# EAGLE design SensorBoard (EAGLE 6.5.0)
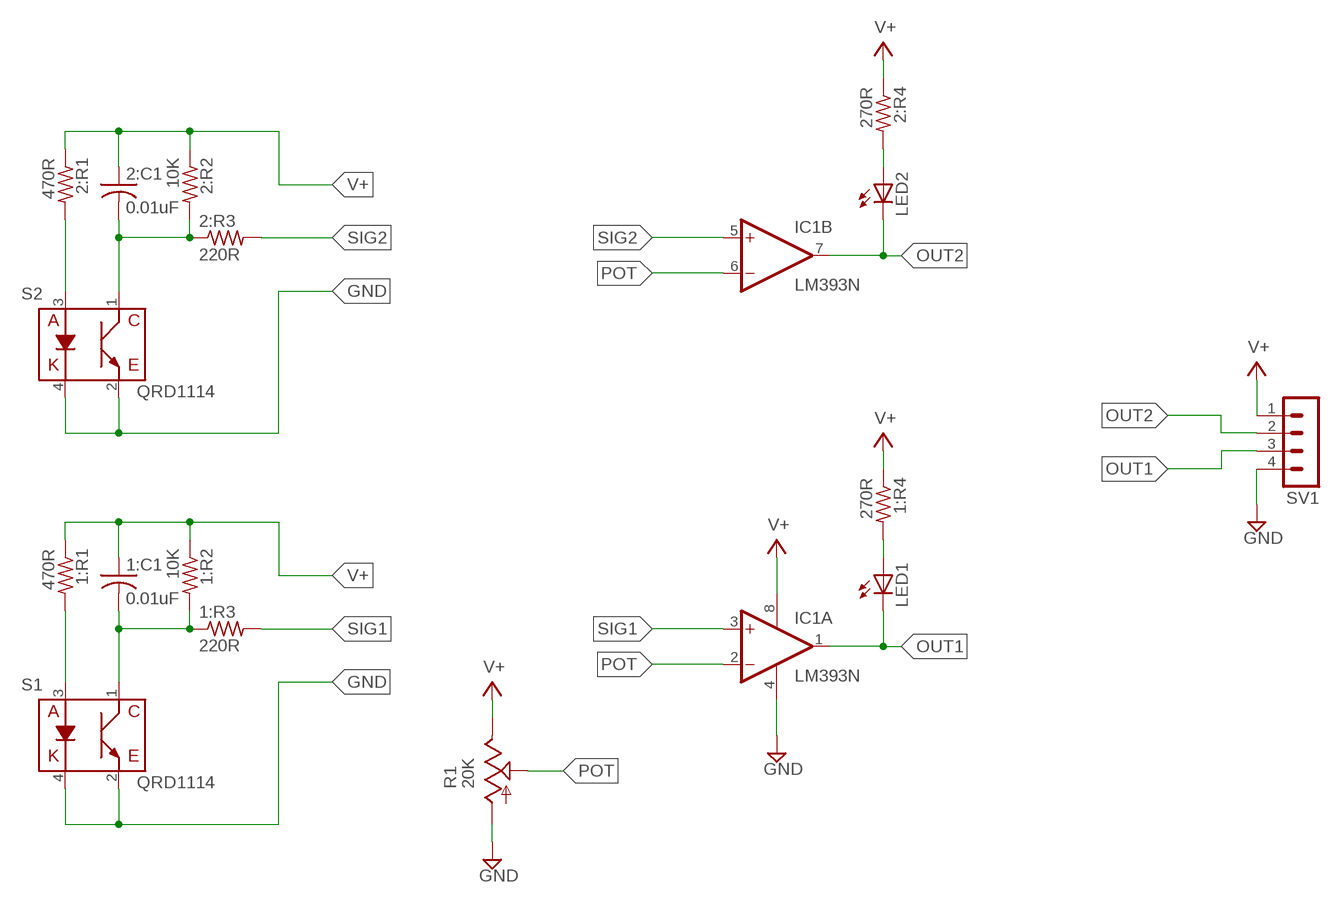
[diagram p0: schematic, sheet 1]

## Parts
1:C1  0.01uF  C-US025-025X050  [C025-025X050]
1:R1  470R  R-US_0207/12  [0207/12]
1:R2  10K  R-US_0207/12  [0207/12]
1:R3  220R  R-US_0207/10  [0207/10]
1:R4  270R  R-US_0207/12  [0207/12]
2:C1  0.01uF  C-US025-025X050  [C025-025X050]
2:R1  470R  R-US_0207/12  [0207/12]
2:R2  10K  R-US_0207/12  [0207/12]
2:R3  220R  R-US_0207/10  [0207/10]
2:R4  270R  R-US_0207/12  [0207/12]
IC1  LM393N  [DIL08]
LED1  LED5MM  [LED5MM]
LED2  LED5MM  [LED5MM]
R1  20K  TRIM_US-B25P  [B25P]
S1  QRD1114  [QRD1114]
S2  QRD1114  [QRD1114]
SV1  MA04-1  [MA04-1]

## Nets
GND: IC1.4(P:V-) R1.A S1.2(C) S1.4(K) S2.2(C) S2.4(K) SV1.4
N$1: 2:R4.2 LED2.A
N$2: 1:C1.2 1:R2.2 1:R3.1 S1.1(E)
N$3: 1:R1.2 S1.3(A)
N$4: 2:C1.2 2:R2.2 2:R3.1 S2.1(E)
N$5: 2:R1.2 S2.3(A)
N$6: 1:R4.2 LED1.A
OUT1: IC1.1(A:OUT) LED1.K(C) SV1.3
OUT2: IC1.7(B:OUT) LED2.K(C) SV1.2
POT: IC1.2(A:-IN) IC1.6(B:-IN) R1.S
SIG1: 1:R3.2 IC1.3(A:+IN)
SIG2: 2:R3.2 IC1.5(B:+IN)
V+: 1:C1.1 1:R1.1 1:R2.1 1:R4.1 2:C1.1 2:R1.1 2:R2.1 2:R4.1 IC1.8(P:V+) R1.E SV1.1

## Library data of the parts
1:C1 2:C1 = resistor:C-US: CAPACITOR, American symbol
1:R1-1:R4 2:R1-2:R4 = resistor:R-US_: RESISTOR, American symbol
IC1 = linear:LM393: COMPARATOR
LED1 LED2 = led:LED: LED OSRAM: - CHIPLED LG R971, LG N971, LY N971, LG Q971, LY Q971, LO R971, LY R971 LH N974, LH R974 LS Q976, LO Q976, LY Q976 LO Q996 - Hyper CHIPLED LW Q18S LB Q993, LB Q99A, LB R99A - SideLED LS A670, LO A670, LY A670, LG A670, LP A670 LB A673, LV A673, LT A673, LW A673 LH A674 LY A675 LS A676, LA A676, LO A676, LY A676, LW A676 LS A679, LY A679, LG A679 - Hyper Micro SIDELED® LS Y876, LA Y876, LO Y876, LY Y876 LT Y87S - SmartLED LW L88C, LW L88S LB L89C, LB L89S, LG L890 LS L89K, LO L89K, LY L89K LS L896, LA L896, LO L896, LY L896 - TOPLED LS T670, LO T670, LY T670, LG T670, LP T670 LSG T670, LSP T670, LSY T670, LOP T670, LYG T670 LG T671, LOG T671, LSG T671 LB T673, LV T673, LT T673, LW T673 LH T674 LS T676, LA T676, LO T676, LY T676, LB T676, LH T676, LSB T676, LW T676 LB T67C, LV T67C, LT T67C, LS T67K, LO T67K, LY T67K, LW E67C LS E67B, LA E67B, LO E67B, LY E67B, LB E67C, LV E67C, LT E67C LW T67C LS T679, LY T679, LG T679 LS T770, LO T770, LY T770, LG T770, LP T770 LB T773, LV T773, LT T773, LW T773 LH T774 LS E675, LA E675, LY E675, LS T675 LS T776, LA T776, LO T776, LY T776, LB T776 LHGB T686 LT T68C, LB T68C - Hyper Mini TOPLED® LB M676 - Mini TOPLED Santana® LG M470 LS M47K, LO M47K, LY M47K Source: http://www.osram.convergy.de LUXEON: - LUMILED® LXK2-PW12-R00, LXK2-PW12-S00, LXK2-PW14-U00, LXK2-PW14-V00 LXK2-PM12-R00, LXK2-PM12-S00, LXK2-PM14-U00 LXK2-PE12-Q00, LXK2-PE12-R00, LXK2-PE12-S00, LXK2-PE14-T00, LXK2-PE14-U00 LXK2-PB12-K00, LXK2-PB12-L00, LXK2-PB12-M00, LXK2-PB14-N00, LXK2-PB14-P00, LXK2-PB14-Q00 LXK2-PR12-L00, LXK2-PR12-M00, LXK2-PR14-Q00, LXK2-PR14-R00 LXK2-PD12-Q00, LXK2-PD12-R00, LXK2-PD12-S00 LXK2-PH12-R00, LXK2-PH12-S00 LXK2-PL12-P00, LXK2-PL12-Q00, LXK2-PL12-R00 Source: www.luxeon.com KINGBRIGHT: KA-3528ASYC Source: www.kingbright.com
R1 = pot:TRIM_US-: POTENTIOMETER
S1 S2 = SparkFun-Sensors:QRD1114: Reflective object sensor
SV1 = con-lstb:MA04-1: PIN HEADER; OC_FARNELL: unknown; OC_NEWARK: unknown

## Board
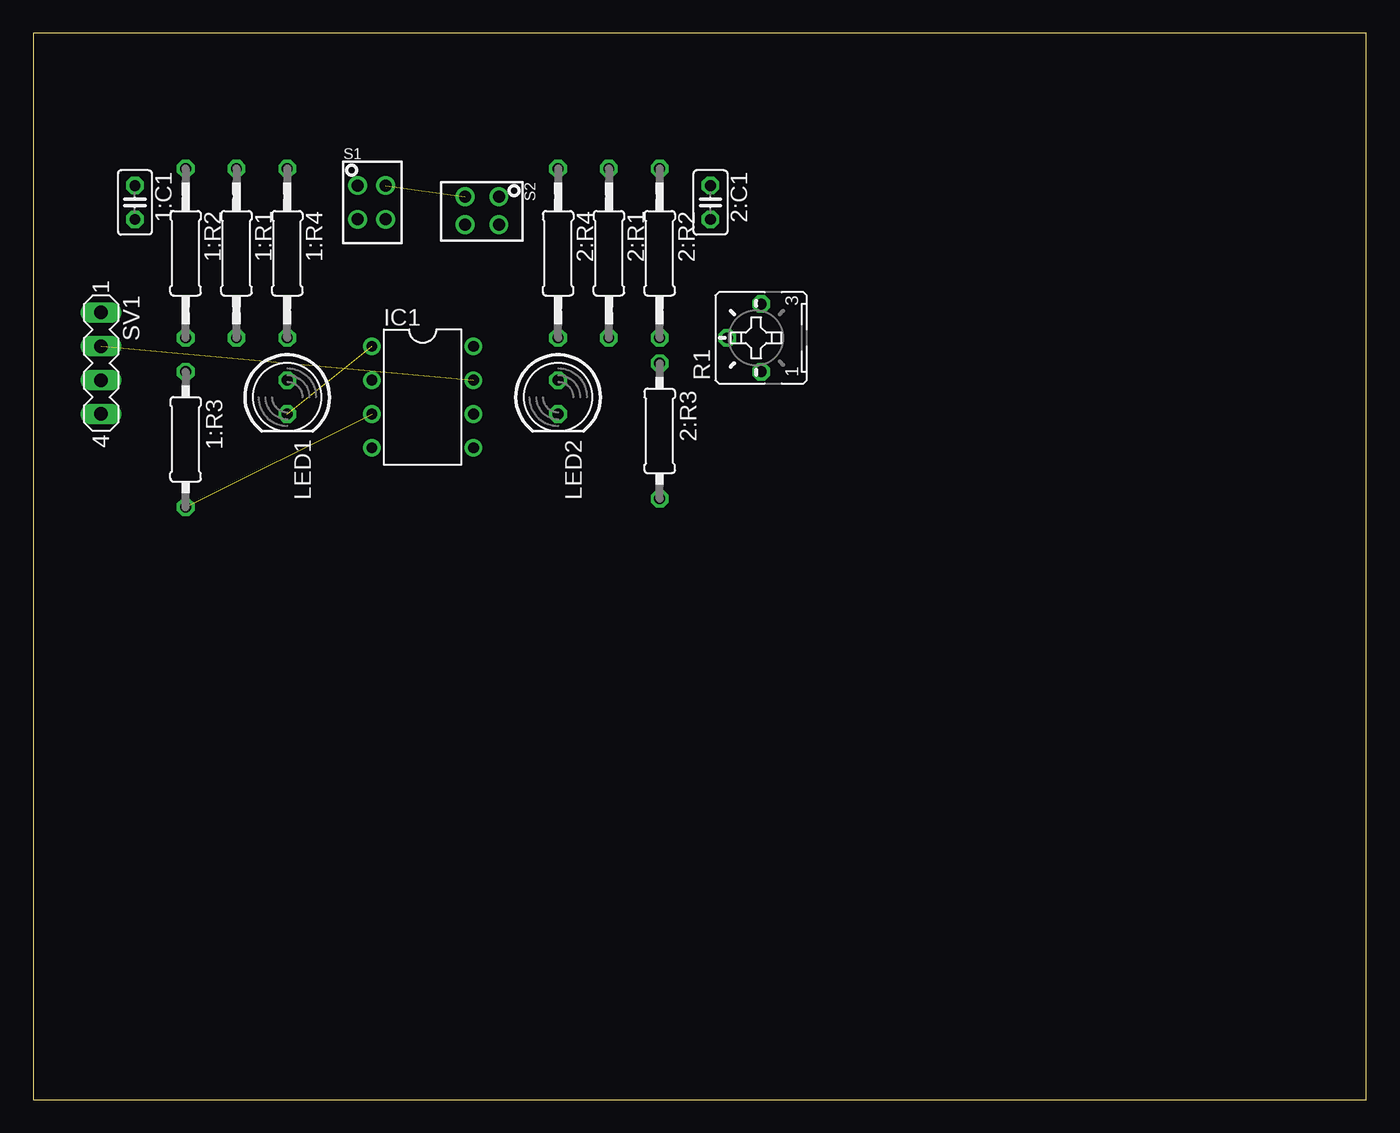
[diagram p1: board, top side]
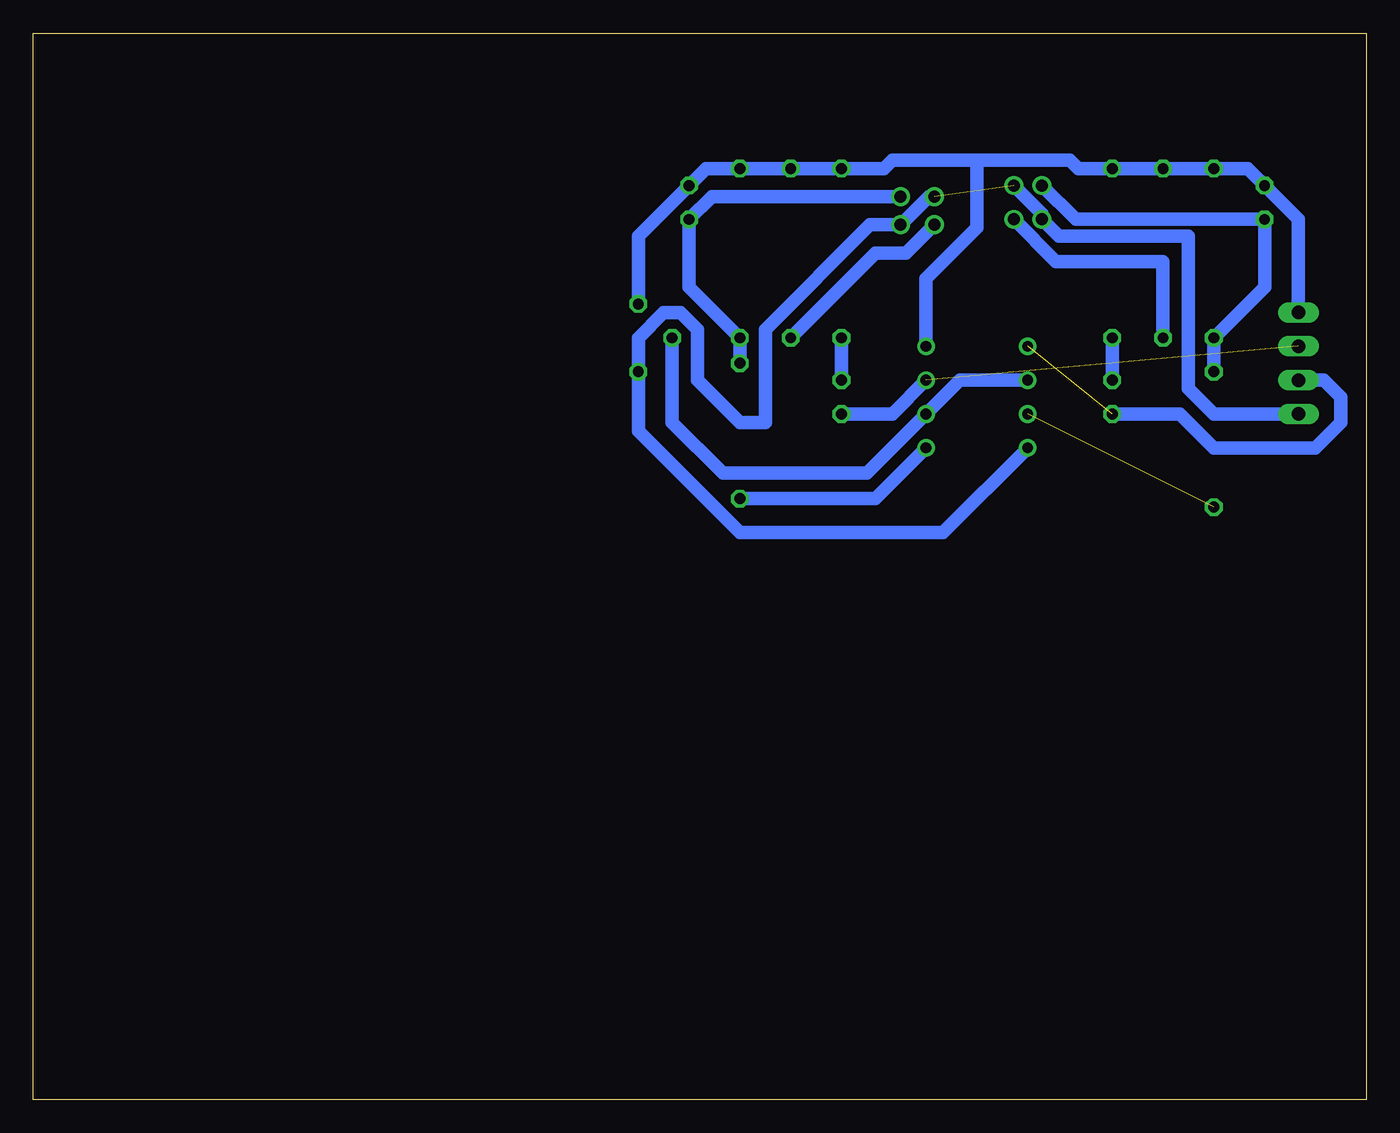
[diagram p2: board, bottom side, seen from below]

Size 100 x 80 mm. Coordinates in mm from the lower left corner, seen from the top.
Outline: 0,0 100,0 100,80 0,80 0,0
Copper layers (1*16): Top 0.035mm / dielectric 1.5mm / Bottom 0.035mm
Design rules "default": minimum track width 10mil, minimum drill 24mil, track to track 8mil, track to pad 8mil, pad to pad 8mil, via to via 8mil, smd to smd 8mil, copper to edge 40mil, drill to drill 8mil, minimum pad ring 10mil, minimum via ring 8mil, stop-mask expansion 4mil, vias tented up to drill 0mil, thermal gap 10mil

### Footprints (pad centres in the part's own frame; a part is rotated, then mirrored left to right if it is on the bottom)
C025-025X050 = drill 0.813 octagon: 1 -1.27,0; 2 1.27,0
0207/12 = drill 0.813 octagon: 1 -6.35,0; 2 6.35,0
0207/10 = drill 0.813 octagon: 1 -5.08,0; 2 5.08,0
DIL08 = drill 0.813 pad 1.27: 1 -3.81,-3.81; 2 -1.27,-3.81; 3 1.27,-3.81; 4 3.81,-3.81; 5 3.81,3.81; 6 1.27,3.81; 7 -1.27,3.81; 8 -3.81,3.81
LED5MM = drill 0.813 octagon: A -1.27,0; K 1.27,0
B25P = drill 0.813 octagon: A -2.54,0; E 2.54,0; S 0,2.54
QRD1114 = drill 0.9: 1 -1.067,1.27; 2 -1.067,-1.27; 3 1.041,-1.27; 4 1.041,1.27
MA04-1 = drill 1.016 long: 1 -3.81,0; 2 -1.27,0; 3 1.27,0; 4 3.81,0

### Placement (x,y rotation side)
1:C1  7.62,67.31 270 top
1:R1  15.24,63.5 270 top
1:R2  11.43,63.5 270 top
1:R3  11.43,49.53 270 top
1:R4  19.05,63.5 270 top
2:C1  50.8,67.31 270 top
2:R1  43.18,63.5 270 top
2:R2  46.99,63.5 270 top
2:R3  46.99,50.16 270 top
2:R4  39.37,63.5 270 top
IC1  29.21,52.7 270 top
LED1  19.05,52.7 270 top
LED2  39.37,52.7 270 top
R1  54.61,57.15 90 top
S1  25.4,67.31 0 top
S2  33.66,66.67 270 top
SV1  5.08,55.24 270 top

### Tracks (layer width: path | path; a pad name or v marks a point on that pad's centre or on a via)
GND  (1 unrouted)
  Bottom 1.016: S1.4 24.33,66.47 S1.2 23.06,64.77 13.34,64.77 13.34,53.34 11.43,51.44 SV1.4 | S2.2 32.82,67.74 S2.4 37.24,65.63 45.09,57.78 45.09,50.8 46.99,50.8 50.16,53.98 50.16,57.78 51.44,59.05 52.7,59.05 54.61,57.15 R1.A 54.61,50.16 46.99,42.55 31.75,42.55 IC1.4
N$1
  Bottom 1.016: 2:R4.2 LED2.A
N$2
  Bottom 1.016: 1:R3.1 1:R2.2 7.62,60.96 1:C1.2 21.79,66.04 S1.1
N$3
  Bottom 1.016: S1.3 23.27,62.87 15.24,62.87 1:R1.2
N$4
  Bottom 1.016: S2.1 49.1,67.74 2:C1.2 50.8,60.96 2:R2.2 2:R3.1
N$5
  Bottom 1.016: S2.3 34.52,63.5 36.83,63.5 2:R1.2
N$6
  Bottom 1.016: 1:R4.2 LED1.A
OUT1  (1 unrouted)
  Bottom 1.016: LED1.K 13.97,51.44 11.43,48.9 3.81,48.9 1.91,50.8 1.91,52.7 3.17,53.98 SV1.3
OUT2  (1 unrouted)
  Bottom 1.016: LED2.K 35.56,51.44 IC1.7
POT
  Bottom 1.016: R1.S 52.07,50.8 48.26,46.99 37.47,46.99 IC1.6 30.48,53.98 IC1.2
SIG1  (1 unrouted)
SIG2
  Bottom 1.016: 2:R3.2 36.83,45.09 IC1.5
V+
  Bottom 1.016: SV1.1 5.08,66.04 1:C1.1 8.89,69.85 1:R2.1 1:R1.1 1:R4.1 21.59,69.85 22.23,70.48 29.21,70.48 | 29.21,70.48 35.56,70.48 36.2,69.85 2:R4.1 2:R1.1 2:R2.1 49.53,69.85 2:C1.1 54.61,64.77 R1.E | IC1.8 33.02,61.59 29.21,65.41 29.21,70.48